# EAGLE schematic Game of Chairs (EAGLE 7.6.0)
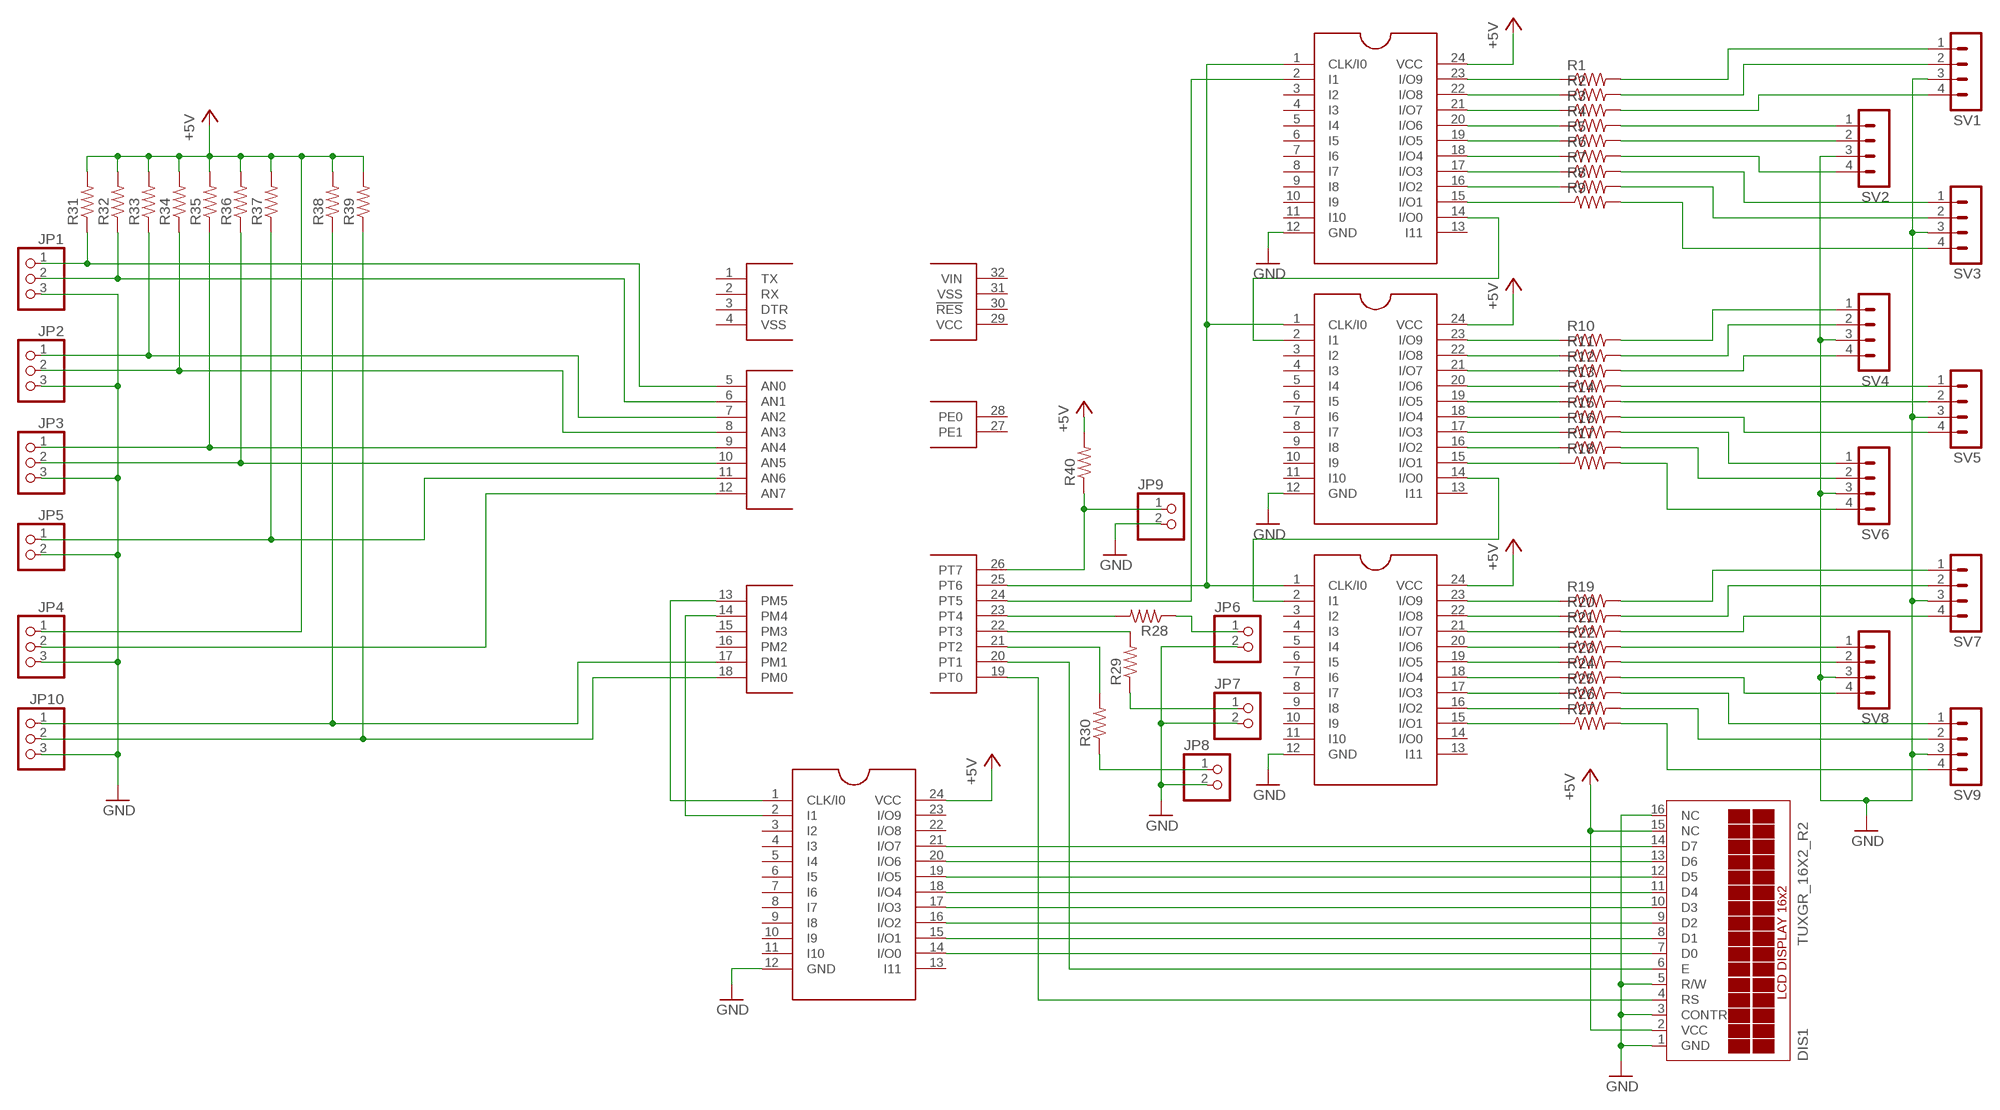
[diagram p0: schematic, sheet 1]

## Parts
DIS1  TUXGR_16X2_R2  [TUXGR_16X2_R2]
GAL1  GAL  [DIL20]
GAL2  GAL  [DIL20]
GAL3  GAL  [DIL20]
GAL4  GAL  [DIL20]
JP1  PINHD-1X3  [1X03]
JP2  PINHD-1X3  [1X03]
JP3  PINHD-1X3  [1X03]
JP4  PINHD-1X3  [1X03]
JP5  PINHD-1X2  [1X02]
JP6  PINHD-1X2  [1X02]
JP7  PINHD-1X2  [1X02]
JP8  PINHD-1X2  [1X02]
JP9  PINHD-1X2  [1X02]
JP10  PINHD-1X3  [1X03]
R1  R-US_0207/12  [0207/12]
R2  R-US_0207/12  [0207/12]
R3  R-US_0207/12  [0207/12]
R4  R-US_0207/12  [0207/12]
R5  R-US_0207/12  [0207/12]
R6  R-US_0207/12  [0207/12]
R7  R-US_0207/12  [0207/12]
R8  R-US_0207/12  [0207/12]
R9  R-US_0207/12  [0207/12]
R10  R-US_0207/12  [0207/12]
R11  R-US_0207/12  [0207/12]
R12  R-US_0207/12  [0207/12]
R13  R-US_0207/12  [0207/12]
R14  R-US_0207/12  [0207/12]
R15  R-US_0207/12  [0207/12]
R16  R-US_0207/12  [0207/12]
R17  R-US_0207/12  [0207/12]
R18  R-US_0207/12  [0207/12]
R19  R-US_0207/12  [0207/12]
R20  R-US_0207/12  [0207/12]
R21  R-US_0207/12  [0207/12]
R22  R-US_0207/12  [0207/12]
R23  R-US_0207/12  [0207/12]
R24  R-US_0207/12  [0207/12]
R25  R-US_0207/12  [0207/12]
R26  R-US_0207/12  [0207/12]
R27  R-US_0207/12  [0207/12]
R28  R-US_0207/12  [0207/12]
R29  R-US_0207/12  [0207/12]
R30  R-US_0207/12  [0207/12]
R31  R-US_0207/12  [0207/12]
R32  R-US_0207/12  [0207/12]
R33  R-US_0207/12  [0207/12]
R34  R-US_0207/12  [0207/12]
R35  R-US_0207/12  [0207/12]
R36  R-US_0207/12  [0207/12]
R37  R-US_0207/12  [0207/12]
R38  R-US_0207/12  [0207/12]
R39  R-US_0207/12  [0207/12]
R40  R-US_0207/12  [0207/12]
SV1  MA04-1  [MA04-1]
SV2  MA04-1  [MA04-1]
SV3  MA04-1  [MA04-1]
SV4  MA04-1  [MA04-1]
SV5  MA04-1  [MA04-1]
SV6  MA04-1  [MA04-1]
SV7  MA04-1  [MA04-1]
SV8  MA04-1  [MA04-1]
SV9  MA04-1  [MA04-1]
U1  362MICRO362MICRO  [40P]

## Nets
+5V: DIS1.2(VCC) DIS1.15(NC) GAL1.24(VCC) GAL2.24(VCC) GAL3.24(VCC) GAL4.24(VCC) JP4.1 R31.2 R32.2 R33.2 R34.2 R35.2 R36.2 R37.2 R38.2 R39.2 R40.2
GND: DIS1.1(GND) DIS1.3(CONTR) DIS1.5(R/W) DIS1.16(NC) GAL1.12(GND) GAL2.12(GND) GAL3.12(GND) GAL4.12(GND) JP1.3 JP2.3 JP3.3 JP4.3 JP5.2 JP6.2 JP7.2 JP8.2 JP9.2 JP10.3 SV1.3 SV2.3 SV3.3 SV4.3 SV5.3 SV6.3 SV7.3 SV8.3 SV9.3
N$1: R1.2 SV1.1
N$2: R2.2 SV1.2
N$3: R3.2 SV1.4
N$4: GAL1.23(I/O9) R1.1
N$5: GAL1.22(I/O8) R2.1
N$6: R6.2 SV2.4
N$7: R7.2 SV3.1
N$8: R8.2 SV3.2
N$9: R9.2 SV3.4
N$10: R10.2 SV4.1
N$11: R11.2 SV4.2
N$12: R12.2 SV4.4
N$13: GAL1.21(I/O7) R3.1
N$14: GAL1.20(I/O6) R4.1
N$15: R15.2 SV5.4
N$16: R16.2 SV6.1
N$17: R17.2 SV6.2
N$18: R18.2 SV6.4
N$19: GAL1.14(I/O0) GAL2.2(I1)
N$20: GAL2.14(I/O0) GAL3.2(I1)
N$21: R19.2 SV7.1
N$22: R20.2 SV7.2
N$23: R21.2 SV7.4
N$24: R4.2 SV2.1
N$25: GAL1.19(I/O5) R5.1
N$26: R24.2 SV8.4
N$27: R25.2 SV9.1
N$28: R26.2 SV9.2
N$29: R27.2 SV9.4
N$30: GAL1.1(CLK/I0) GAL2.1(CLK/I0) GAL3.1(CLK/I0) U1.25(PT6)
N$31: GAL1.2(I1) U1.24(PT5)
N$32: GAL4.1(CLK/I0) U1.13(PM5)
N$33: GAL4.2(I1) U1.14(PM4)
N$34: R5.2 SV2.2
N$35: GAL1.18(I/O4) R6.1
N$36: GAL1.17(I/O3) R7.1
N$37: GAL1.16(I/O2) R8.1
N$38: GAL1.15(I/O1) R9.1
N$39: GAL2.23(I/O9) R10.1
N$40: GAL2.22(I/O8) R11.1
N$41: GAL2.21(I/O7) R12.1
N$42: GAL2.20(I/O6) R13.1
N$43: GAL2.19(I/O5) R14.1
N$44: GAL2.18(I/O4) R15.1
N$45: GAL2.17(I/O3) R16.1
N$46: GAL2.16(I/O2) R17.1
N$47: GAL2.15(I/O1) R18.1
N$48: R14.2 SV5.2
N$49: R13.2 SV5.1
N$50: GAL3.23(I/O9) R19.1
N$51: GAL3.22(I/O8) R20.1
N$52: GAL3.21(I/O7) R21.1
N$53: GAL3.20(I/O6) R22.1
N$54: GAL3.19(I/O5) R23.1
N$55: GAL3.18(I/O4) R24.1
N$56: GAL3.17(I/O3) R25.1
N$57: GAL3.16(I/O2) R26.1
N$58: GAL3.15(I/O1) R27.1
N$59: R23.2 SV8.2
N$60: R22.2 SV8.1
N$61: JP1.1 R31.1 U1.5(AN0)
N$62: JP1.2 R32.1 U1.6(AN1)
N$63: JP2.1 R33.1 U1.7(AN2)
N$64: JP2.2 R34.1 U1.8(AN3)
N$65: JP3.1 R35.1 U1.9(AN4)
N$66: JP3.2 R36.1 U1.10(AN5)
N$67: JP5.1 R37.1 U1.11(AN6)
N$68: JP9.1 R40.1 U1.26(PT7)
N$69: JP10.1 R38.1 U1.17(PM1)
N$70: JP10.2 R39.1 U1.18(PM0)
N$71: JP4.2 U1.12(AN7)
N$72: R28.2 U1.23(PT4)
N$73: JP6.1 R28.1
N$74: R29.2 U1.22(PT3)
N$75: R30.2 U1.21(PT2)
N$76: JP7.1 R29.1
N$77: JP8.1 R30.1
N$78: DIS1.6(E) U1.20(PT1)
N$79: DIS1.4(RS) U1.19(PT0)
N$80: DIS1.7(D0) GAL4.14(I/O0)
N$81: DIS1.8(D1) GAL4.15(I/O1)
N$82: DIS1.9(D2) GAL4.16(I/O2)
N$83: DIS1.10(D3) GAL4.17(I/O3)
N$84: DIS1.11(D4) GAL4.18(I/O4)
N$85: DIS1.12(D5) GAL4.19(I/O5)
N$86: DIS1.13(D6) GAL4.20(I/O6)
N$87: DIS1.14(D7) GAL4.21(I/O7)
Unconnected: GAL1.3(I2) GAL1.4(I3) GAL1.5(I4) GAL1.6(I5) GAL1.7(I6) GAL1.8(I7) GAL1.9(I8) GAL1.10(I9) GAL1.11(I10) GAL1.13(I11) GAL2.3(I2) GAL2.4(I3) GAL2.5(I4) GAL2.6(I5) GAL2.7(I6) GAL2.8(I7) GAL2.9(I8) GAL2.10(I9) GAL2.11(I10) GAL2.13(I11) GAL3.3(I2) GAL3.4(I3) GAL3.5(I4) GAL3.6(I5) GAL3.7(I6) GAL3.8(I7) GAL3.9(I8) GAL3.10(I9) GAL3.11(I10) GAL3.13(I11) GAL3.14(I/O0) GAL4.3(I2) GAL4.4(I3) GAL4.5(I4) GAL4.6(I5) GAL4.7(I6) GAL4.8(I7) GAL4.9(I8) GAL4.10(I9) GAL4.11(I10) GAL4.13(I11) GAL4.22(I/O8) GAL4.23(I/O9) U1.1(TX) U1.2(RX) U1.3(DTR) U1.4(VSS) U1.15(PM3) U1.16(PM2) U1.27(PE1) U1.28(PE0) U1.29(VCC) U1.30(!RES) U1.31(VSS) U1.32(VIN)

## Library data of the parts
DIS1 = display-lcd:TUXGR_16X2_R2: Tuxgraphics LCD display 16x2 characters reflective, without background light Source: tuxgr_12x2_r2.pdf; OC_FARNELL: unknown; OC_NEWARK: unknown
GAL1-GAL4 = 362 parts:GAL
JP1-JP4 JP10 = pinhead:PINHD-1X3: PIN HEADER
JP5-JP9 = pinhead:PINHD-1X2: PIN HEADER
R1-R40 = resistor:R-US_: RESISTOR, American symbol
SV1-SV9 = con-lstb:MA04-1: PIN HEADER; OC_FARNELL: unknown; OC_NEWARK: unknown
U1 = 362 parts:362MICRO